# Altium schematic sheet Buck Converter.SchDoc
size A4; SheetNumber: 4; SheetTotal: 4
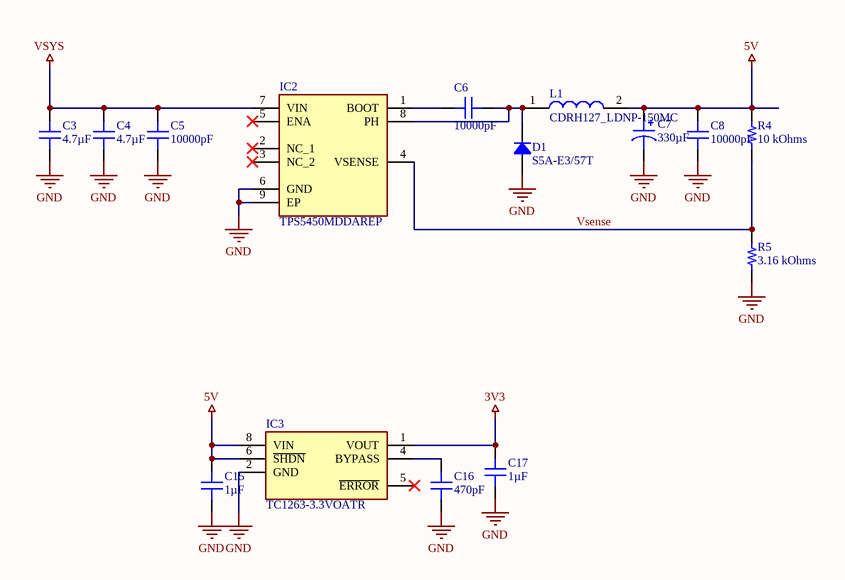
[diagram p0: Buck Converter.SchDoc]

## Parts
C3  4.7µF  [CAP 1206_3216 - 1.0MM]
C4  4.7µF  [CAP 1206_3216 - 1.0MM]
C5  10000pF  [CAP 0603_1608]
C6  10000pF  [CAP 0603_1608]
C7  330µF  [CAP ALSMD 6.6MM H7.7MM]
C8  10000pF  [CAP 0603_1608]
C15  1µF  [CAP 0603_1608]
C16  470pF  [CAP 0603_1608]
C17  1µF  [CAP 0603_1608]
D1  S5A-E3/57T  [DO214AB SMC]
IC2  TPS5450MDDAREP  [SOIC127P600X170-9N]
IC3  TC1263-3.3VOATR  [SOIC127P600X175-8N]
L1  CDRH127_LDNP-150MC  [INDPM120120X800N]
R4  10 kOhms  [RES 0603_1608]
R5  3.16 kOhms  [RES 0603_1608]

## Nets
3V3: C17.2 IC3.1(VOUT)
5V: C7.1 C8.2 C15.2 IC3.6(~{SHDN}) IC3.8(VIN) L1.2 R4.2
GND: C3.1 C4.1 C5.1 C7.2 C8.1 C15.1 C16.1 C17.1 D1.1 IC2.6(GND) IC2.9(EP) IC3.2(GND) R5.1
VSYS: C3.2 C4.2 C5.2 IC2.7(VIN)
Vsense: IC2.4(VSENSE) R4.1 R5.2
NetC6_1: C6.1 D1.2 IC2.8(PH) L1.1
NetC6_2: C6.2 IC2.1(BOOT)
NetC16_2: C16.2 IC3.4(BYPASS)

Not connected (* = marked no-connect by the designer): IC2 2(NC_1)* 3(NC_2)* 5(ENA)*; IC3 5(~{ERROR})*

## Library data of the parts
C3 C4 = C3216X7R1E475K085AB: CAP CER 4.7UF 25V X7R 1206; Manufacturer: TDK Corporation; Tolerance: ±10%; Part Number: C3216X7R1E475K085AB; Value: 4.7µF; Applications: General Purpose; Capacitance: 4.7µF; ComponentLink1Description: Datasheet; ComponentLink1URL: https://product.tdk.com/info/en/catalog/datasheets/mlcc_commercial_general_en.pdf?ref_disty=digikey; ComponentLink2Description: DigiKey Link; ComponentLink2URL: http://digikey.com/product-detail/en/tdk-corporation/C3216X7R1E475K085AB/445-14797-1-ND/3956463; Device Package: 1206 (3216 Metric); Features: Low ESL; LastUpdated: 2020-09-02 1:05:06 AM; Lifecycle Status: Active; Minimum Order: 1; Mounting Type: Surface Mount, MLCC; Operating Temperature: -55°C ~ 125°C; Package / Case: 1206 (3216 Metric); Packaging: TapeAndReel; PartId: 19105; Part Status: Active; Price: 0.08; Series: C; Size / Dimension: 0.126" L x 0.063" W (3.20mm x 1.60mm); Supplier 1: DigiKey; Supplier Part Number 1: 445-14797-1-ND; Temperature Coefficient: X7R; Thickness (Max): 0.039" (1.00mm); Voltage - Rated: 25V
C5 C6 C8 = C0603C103K5RAC7081: CE SMD 0603 .01UF 10% 50V X7R 2M; Manufacturer: KEMET; Part Number: C0603C103K5RAC7081; Value: 10000pF; Applications: Bypass, Decoupling; Capacitance: 10000pF; ComponentLink1Description: Datasheet; ComponentLink1URL: https://api.kemet.com/component-edge/download/specsheet/C0603C103K5RAC7081.pdf; ComponentLink2Description: DigiKey Link; ComponentLink2URL: http://digikey.com/product-detail/en/kemet/C0603C103K5RAC7081/399-C0603C103K5RAC7081CT-ND/10483117; Device Package: 0603 (1608 Metric); LastUpdated: 2020-09-02 1:03:31 AM; Lifecycle Status: Active; Minimum Order: 1; Mounting Type: Surface Mount, MLCC; Operating Temperature: -55°C ~ 125°C; Package / Case: 0603 (1608 Metric); Packaging: TapeAndReel; PartId: 5246; Part Status: Active; Price: 0.01; Series: SMD Comm X7R; Size / Dimension: 0.063" L x 0.031" W (1.60mm x 0.80mm); Supplier 1: DigiKey; Supplier Part Number 1: 399-C0603C103K5RAC7081CT-ND; Temperature Coefficient: X7R; Thickness (Max): 0.034" (0.87mm); Tolerance: ±10%; Voltage - Rated: 50V
C7 = 875105245015: CAP ALUM POLY 330UF 20% 10V SMD; Manufacturer: Würth Elektronik; ESR (Equivalent Series Resistance): 20mOhm; Lifetime @ Temp.: 2000 Hrs @ 105°C; Ripple Current @ High Frequency: 2.69A @ 100kHz; Ripple Current @ Low Frequency: 134.5mA @ 120Hz; Surface Mount Land Size: 0.260" L x 0.260" W (6.60mm x 6.60mm); Type: Polymer; Part Number: 875105245015; Applications: General Purpose; Capacitance: 330µF; ComponentLink1Description: Datasheet; ComponentLink1URL: https://katalog.we-online.de/pbs/datasheet/875105245015.pdf; ComponentLink2Description: DigiKey Link; ComponentLink2URL: http://digikey.com/product-detail/en/w-rth-elektronik/875105245015/732-6415-1-ND/5147966; Device Package: Radial, Can - SMD; Height - Seated (Max): 0.303" (7.70mm); LastUpdated: 2020-09-02 1:25:32 AM; Lifecycle Status: Active; Minimum Order: 1; Mounting Type: Surface Mount; Operating Temperature: -55°C ~ 105°C; Package / Case: Radial, Can - SMD; Packaging: TapeAndReel; PartId: 2228; Part Status: Active; Price: 0.40; Series: WCAP-PSLP; Size / Dimension: 0.248" Dia (6.30mm); Supplier 1: DigiKey; Supplier Part Number 1: 732-6415-1-ND; Tolerance: ±20%; Value: 330µF; Voltage - Rated: 10V
C15 C17 = C0603C105K4RACAUTO: CAP CER 0603 1UF 16V X7R 10%; Manufacturer: KEMET; Part Number: C0603C105K4RACAUTO; Value: 1µF; Applications: Automotive, Bypass, Decoupling; Capacitance: 1µF; ComponentLink1Description: Datasheet; ComponentLink1URL: https://api.kemet.com/component-edge/download/datasheet/C0603C105K4RACAUTO.pdf; ComponentLink2Description: DigiKey Link; ComponentLink2URL: http://digikey.com/product-detail/en/kemet/C0603C105K4RACAUTO/399-17704-1-ND/8635855; Device Package: 0603 (1608 Metric); LastUpdated: 2020-09-02 1:03:36 AM; Lifecycle Status: Active; Minimum Order: 1; Mounting Type: Surface Mount, MLCC; Operating Temperature: -55°C ~ 125°C; Package / Case: 0603 (1608 Metric); Packaging: TapeAndReel; PartId: 2179; Part Status: Active; Price: 0.02; Ratings: AEC-Q200; Series: SMD Auto X7R; Size / Dimension: 0.063" L x 0.031" W (1.60mm x 0.80mm); Supplier 1: DigiKey; Supplier Part Number 1: 399-17704-1-ND; Temperature Coefficient: X7R; Thickness (Max): 0.037" (0.95mm); Tolerance: ±10%; Voltage - Rated: 16V
C16 = C0603C471J3GACAUTO: CAP CER 470PF 25V C0G/NP0 0603; Manufacturer: KEMET; Temperature Coefficient: C0G, NP0; Tolerance: ±5%; Part Number: C0603C471J3GACAUTO; Value: 470pF; Applications: Automotive; Capacitance: 470pF; ComponentLink1Description: Datasheet; ComponentLink1URL: https://api.kemet.com/component-edge/download/datasheet/C0603C471J3GACAUTO.pdf; ComponentLink2Description: DigiKey Link; ComponentLink2URL: http://digikey.com/product-detail/en/kemet/C0603C471J3GACAUTO/399-6891-1-ND/3314402; Device Package: 0603 (1608 Metric); Features: Low ESL; LastUpdated: 2020-09-02 1:03:35 AM; Lifecycle Status: Active; Minimum Order: 1; Mounting Type: Surface Mount, MLCC; Operating Temperature: -55°C ~ 125°C; Package / Case: 0603 (1608 Metric); Packaging: TapeAndReel; PartId: 2407; Part Status: Active; Price: 0.08; Ratings: AEC-Q200; Series: SMD Auto C0G; Size / Dimension: 0.063" L x 0.031" W (1.60mm x 0.80mm); Supplier 1: DigiKey; Supplier Part Number 1: 399-6891-1-ND; Thickness (Max): 0.034" (0.87mm); Voltage - Rated: 25V
D1 = S5A-E3/57T: DIODE GEN PURP 50V 5A DO214AB; Manufacturer: Vishay Semiconductor Diodes Division; Capacitance @ Vr, F: 40pF @ 4V, 1MHz; Current - Reverse Leakage @ Vr: 10µA @ 50V; Diode Type: Standard; Reverse Recovery Time (trr): 2.5µs; Speed: Standard Recovery >500ns, > 200mA (Io); Voltage - Forward (Vf) (Max) @ If: 1.15V @ 5A; Part Number: S5A-E3/57T; ComponentLink1Description: Datasheet; ComponentLink1URL: http://www.vishay.com/docs/88931/s5a.pdf; ComponentLink2Description: DigiKey Link; ComponentLink2URL: http://digikey.com/product-detail/en/vishay-semiconductor-diodes-division/S5A-E3-57T/S5A-E3-57TGICT-ND/3646220; Current - Average Rectified (Io): 5A; LastUpdated: 2020-09-02 1:18:57 AM; Lifecycle Status: Active; Minimum Order: 1; Mounting Type: Surface Mount; Operating Temperature - Junction: -55°C ~ 150°C; Package / Case: DO-214AB, SMC; Packaging: TapeAndReel; PartId: 381; Part Status: Active; Price: 0.20; Series: -; Supplier 1: DigiKey; Supplier Part Number 1: S5A-E3/57TGICT-ND; Supplier Device Package: DO-214AB (SMC); Voltage - DC Reverse (Vr) (Max): 50V
IC2 = TPS5450MDDAREP: Integrated Circuit; Manufacturer_Name: Texas Instruments; Datasheet Link: http://www.ti.com/lit/gpn/tps5450-ep; Height: 1.7mm; Manufacturer_Part_Number: TPS5450MDDAREP
IC3 = TC1263-3.3VOATR: Integrated Circuit; Manufacturer_Name: Microchip; Datasheet Link: http://ww1.microchip.com/downloads/en/DeviceDoc/21374D.pdf; Height: 1.75mm; Manufacturer_Part_Number: TC1263-3.3VOATR; Mouser Part Number: 579-TC1263-3.3VOATR; Mouser Price/Stock: https://www.mouser.co.uk/ProductDetail/Microchip-Technology/TC1263-33VOATR?qs=JKWmWPM4binFIJC0VNJYCQ%3D%3D; Arrow Part Number: TC1263-3.3VOATR; Arrow Price/Stock: https://www.arrow.com/en/products/tc1263-3.3voatr/microchip-technology
L1 = CDRH127_LDNP-150MC: Inductor; Manufacturer_Name: Sumida; Manufacturer_Part_Number: CDRH127/LDNP-150MC; Datasheet Link: https://componentsearchengine.com/Datasheets/1/CDRH127_LDNP-150MC.pdf; Height: 8mm; Mouser Part Number: 851-CDRH127LDNP150MC; Mouser Price/Stock: https://www.mouser.co.uk/ProductDetail/Sumida/CDRH127-LDNP-150MC?qs=UC6tolJH7OiTViEpne7nQQ%3D%3D; Arrow Part Number: CDRH127/LDNP-150MC; Arrow Price/Stock: https://www.arrow.com/en/products/cdrh127ldnp-150mc/sumida?region=nac
R4 = AF0603FR-0710KL: RES SMD 10K OHM 1% 1/10W 0603; Manufacturer: Yageo; Power (Watts): 0.1W, 1/10W; Temperature Coefficient: ±100ppm/°C; Part Number: AF0603FR-0710KL; Value: 10 kOhms; ComponentLink1Description: Datasheet; ComponentLink1URL: http://www.yageo.com/documents/recent/PYu-AF_51_RoHS_L_6.pdf; ComponentLink2Description: DigiKey Link; ComponentLink2URL: http://digikey.com/product-detail/en/yageo/AF0603FR-0710KL/311-10KLMCT-ND/2828170; Composition: Thick Film; Device Package: 0603 (1608 Metric); Features: Anti-Sulfur, Moisture Resistant; Height - Seated (Max): 0.022" (0.55mm); LastUpdated: 2020-09-02 1:10:01 AM; Lifecycle Status: Active; Minimum Order: 1; Number of Terminations: 2; Operating Temperature: -55°C ~ 155°C; Package / Case: 0603 (1608 Metric); Packaging: TapeAndReel; PartId: 16021; Part Status: Active; Price: 0.01; Resistance: 10 kOhms; Series: AF; Size / Dimension: 0.063" L x 0.031" W (1.60mm x 0.80mm); Supplier 1: DigiKey; Supplier Part Number 1: 311-10KLMCT-ND; Supplier Device Package: 0603; Tolerance: ±1%
R5 = CR0603-FX-3161ELF: RES SMD 3.16K OHM 1% 1/10W 0603; Manufacturer: Bourns Inc.; Power (Watts): 0.1W, 1/10W; Temperature Coefficient: ±100ppm/°C; Part Number: CR0603-FX-3161ELF; Value: 3.16 kOhms; ComponentLink1Description: Datasheet; ComponentLink1URL: https://www.bourns.com/docs/Product-Datasheets/CHPREZTR.pdf; ComponentLink2Description: DigiKey Link; ComponentLink2URL: http://digikey.com/product-detail/en/bourns-inc/CR0603-FX-3161ELF/CR0603-FX-3161ELFCT-ND/4247773; Composition: Thick Film; Device Package: 0603 (1608 Metric); Features: Moisture Resistant; Height - Seated (Max): 0.022" (0.55mm); LastUpdated: 2020-09-02 1:10:18 AM; Lifecycle Status: Active; Minimum Order: 1; Number of Terminations: 2; Operating Temperature: -55°C ~ 155°C; Package / Case: 0603 (1608 Metric); Packaging: CutTape; PartId: 8282; Part Status: Active; Price: 0.10; Resistance: 3.16 kOhms; Series: CR0603; Size / Dimension: 0.063" L x 0.031" W (1.60mm x 0.80mm); Supplier 1: DigiKey; Supplier Part Number 1: CR0603-FX-3161ELFCT-ND; Supplier Device Package: 0603; Tolerance: ±1%